# EAGLE design v1 (EAGLE 7.3.0)
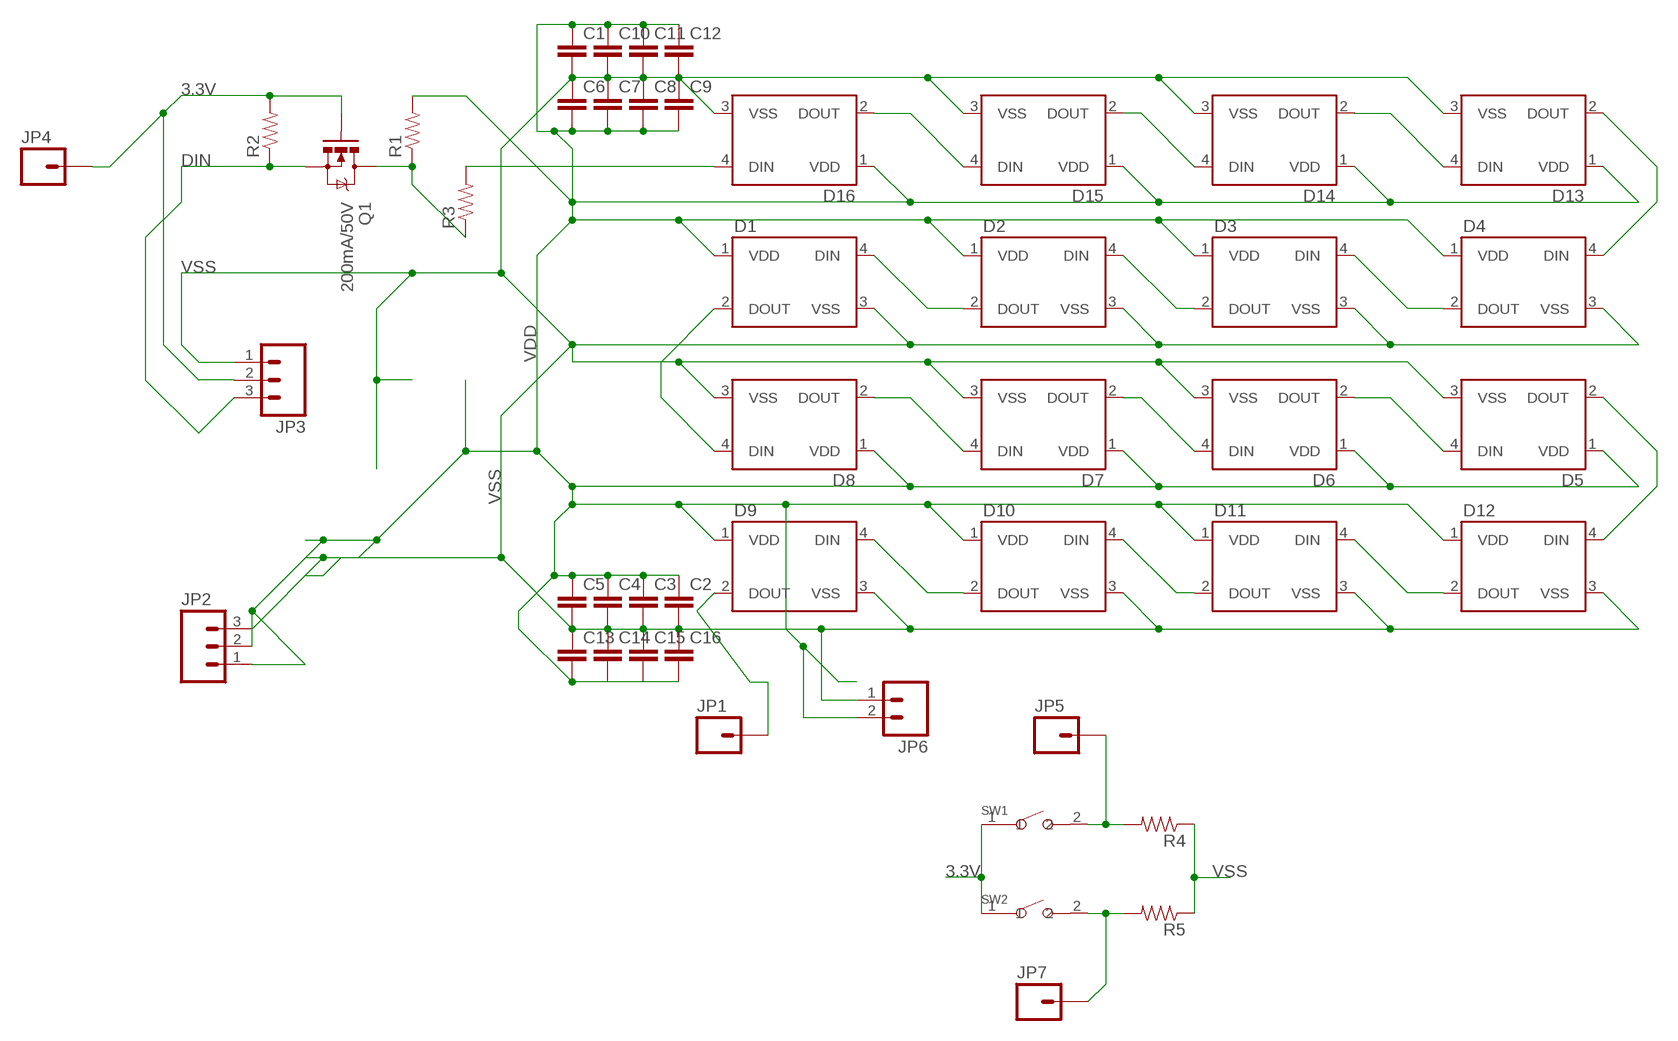
[diagram p0: schematic, sheet 1]

## Parts
C1  CAP0805  [0805]
C2  CAP0805  [0805]
C3  CAP0805  [0805]
C4  CAP0805  [0805]
C5  CAP0805  [0805]
C6  CAP0805  [0805]
C7  CAP0805  [0805]
C8  CAP0805  [0805]
C9  CAP0805  [0805]
C10  CAP0805  [0805]
C11  CAP0805  [0805]
C12  CAP0805  [0805]
C13  CAP0805  [0805]
C14  CAP0805  [0805]
C15  CAP0805  [0805]
C16  CAP0805  [0805]
D1  WS2812B  [WS2812B]
D2  WS2812B  [WS2812B]
D3  WS2812B  [WS2812B]
D4  WS2812B  [WS2812B]
D5  WS2812B  [WS2812B]
D6  WS2812B  [WS2812B]
D7  WS2812B  [WS2812B]
D8  WS2812B  [WS2812B]
D9  WS2812B  [WS2812B]
D10  WS2812B  [WS2812B]
D11  WS2812B  [WS2812B]
D12  WS2812B  [WS2812B]
D13  WS2812B  [WS2812B]
D14  WS2812B  [WS2812B]
D15  WS2812B  [WS2812B]
D16  WS2812B  [WS2812B]
JP1  M01PTH  [1X01]
JP2  M03PTH  [1X03]
JP3  M03PTH  [1X03]
JP4  M01PTH  [1X01]
JP5  M01PTH  [1X01]
JP6  M02PTH  [1X02]
JP7  M01PTH  [1X01]
Q1  200mA/50V  MOSFET-NCHANNELBSS138  [SOT23-3]
R1  RESISTOR0805-RES  [0805]
R2  RESISTOR0805-RES  [0805]
R3  RESISTOR0805-RES  [0805]
R4  RESISTOR0805-RES  [0805]
R5  RESISTOR0805-RES  [0805]
SW1  SMD-BUTTON(2P-6.0X3.0X2.5MM)-DHT-1163S  [SW2-4.0-6.0X3.0X2.5MM]
SW2  SMD-BUTTON(2P-6.0X3.0X2.5MM)-DHT-1163S  [SW2-4.0-6.0X3.0X2.5MM]

## Nets
3.3V: JP3.2 JP4.1 Q1.1(G) R2.2 SW1.1 SW2.1
DIN: JP3.3 Q1.2(S) R2.1
N$1: D3.4(DIN) D4.2(DOUT)
N$2: D2.4(DIN) D3.2(DOUT)
N$3: D1.4(DIN) D2.2(DOUT)
N$4: D11.4(DIN) D12.2(DOUT)
N$5: D10.4(DIN) D11.2(DOUT)
N$6: D9.4(DIN) D10.2(DOUT)
N$7: D4.4(DIN) D13.2(DOUT)
N$8: D5.2(DOUT) D12.4(DIN)
N$9: D1.2(DOUT) D8.4(DIN)
N$10: D7.4(DIN) D8.2(DOUT)
N$11: D6.4(DIN) D7.2(DOUT)
N$12: D5.4(DIN) D6.2(DOUT)
N$13: D15.4(DIN) D16.2(DOUT)
N$14: D14.4(DIN) D15.2(DOUT)
N$15: D13.4(DIN) D14.2(DOUT)
N$16: D9.2(DOUT) JP1.1
N$17: D16.4(DIN) R3.2
N$18: Q1.3(D) R1.1 R3.1
N$20: JP5.1 R4.2 SW1.2
N$21: JP7.1 R5.2 SW2.2
VDD: C1.1 C2.1 C3.1 C4.1 C5.1 C6.2 C7.2 C8.2 C9.2 C10.1 C11.1 C12.1 C13.2 C16.2 D1.1(VDD) D2.1(VDD) D3.1(VDD) D4.1(VDD) D5.1(VDD) D6.1(VDD) D7.1(VDD) D8.1(VDD) D9.1(VDD) D10.1(VDD) D11.1(VDD) D12.1(VDD) D13.1(VDD) D14.1(VDD) D15.1(VDD) D16.1(VDD) JP2.1 JP2.3 JP6.2 R1.2
VSS: C1.2 C2.2 C3.2 C4.2 C5.2 C6.1 C7.1 C8.1 C9.1 C10.2 C11.2 C12.2 C13.1 C14.1 C15.1 C16.1 D1.3(VSS) D2.3(VSS) D3.3(VSS) D4.3(VSS) D5.3(VSS) D6.3(VSS) D7.3(VSS) D8.3(VSS) D9.3(VSS) D10.3(VSS) D11.3(VSS) D12.3(VSS) D13.3(VSS) D14.3(VSS) D15.3(VSS) D16.3(VSS) JP2.2 JP3.1 JP6.1 R4.1 R5.1
Unconnected: C14.2 C15.2

## Library data of the parts
C1-C16 = SparkFun-Capacitors:CAP: Capacitor Standard 0603 ceramic capacitor, and 0.1" leaded capacitor.
D1-D16 = SparkFun-LED:WS2812B: WS2812B - Intelligent control LED integrated light source Technical Specifications: Power Supply Voltage (VDD): 3.5 to 5.3 V Input Voltage (VI): -0.5 to VDD+0.5 V Operating Junction Temperature (Topt): -25°C to +80°C Storage Temperature Range (Tstg): -55°C to +150°C; PROD_ID: DIO-12503
JP1 JP4 JP5 JP7 = SparkFun-Connectors:M01: Header 1 Standard 1-pin 0.1" header. Use with straight break away headers (SKU : PRT-00116), right angle break away headers (PRT-00553), swiss pins (PRT-00743), machine pins (PRT-00117), and female headers (PRT-00115).
JP2 JP3 = SparkFun-Connectors:M03: Header 3 Standard 3-pin 0.1" header. Use with straight break away headers (SKU : PRT-00116), right angle break away headers (PRT-00553), swiss pins (PRT-00743), machine pins (PRT-00117), and female headers (PRT-00115). Molex polarized connector foot print use with SKU : PRT-08232 with associated crimp pins and housings.
JP6 = SparkFun-Connectors:M02: Standard 2-pin 0.1" header. Use with - straight break away headers ( PRT-00116) - right angle break away headers (PRT-00553) - swiss pins (PRT-00743) - machine pins (PRT-00117) - female headers (PRT-00115) Molex polarized connector foot print use with: PRT-08233 with associated crimp pins and housings. 2.54_SCREWTERM for use with PRT-10571. 3.5mm Screw Terminal footprints for PRT-08084 5mm Screw Terminal footprints for use with PRT-08432
Q1 = SparkFun-DiscreteSemi:MOSFET-NCHANNEL: Common NMOSFET Parts MFG P/N Store ID Prod ID FDD8780 TRANS-09984 SI7820DN TRANS-11055 FDS6630A IC-08089 2N7002PW TRANS-11151 FQP30N06L COM-10213 TRANS-10060 BSS123LT1G TRANS-08345 BSS138 TRANS-00830 BS170 2N7000; PROD_ID: TRANS-00830
R1-R5 = SparkFun-Passives:RESISTOR: Resistor Basic schematic elements and footprints for 0603, 1206, and PTH resistors.
SW1 SW2 = Seeed-OPL-Switch:SMD-BUTTON(2P-6.0X3.0X2.5MM): 311020029

## Board
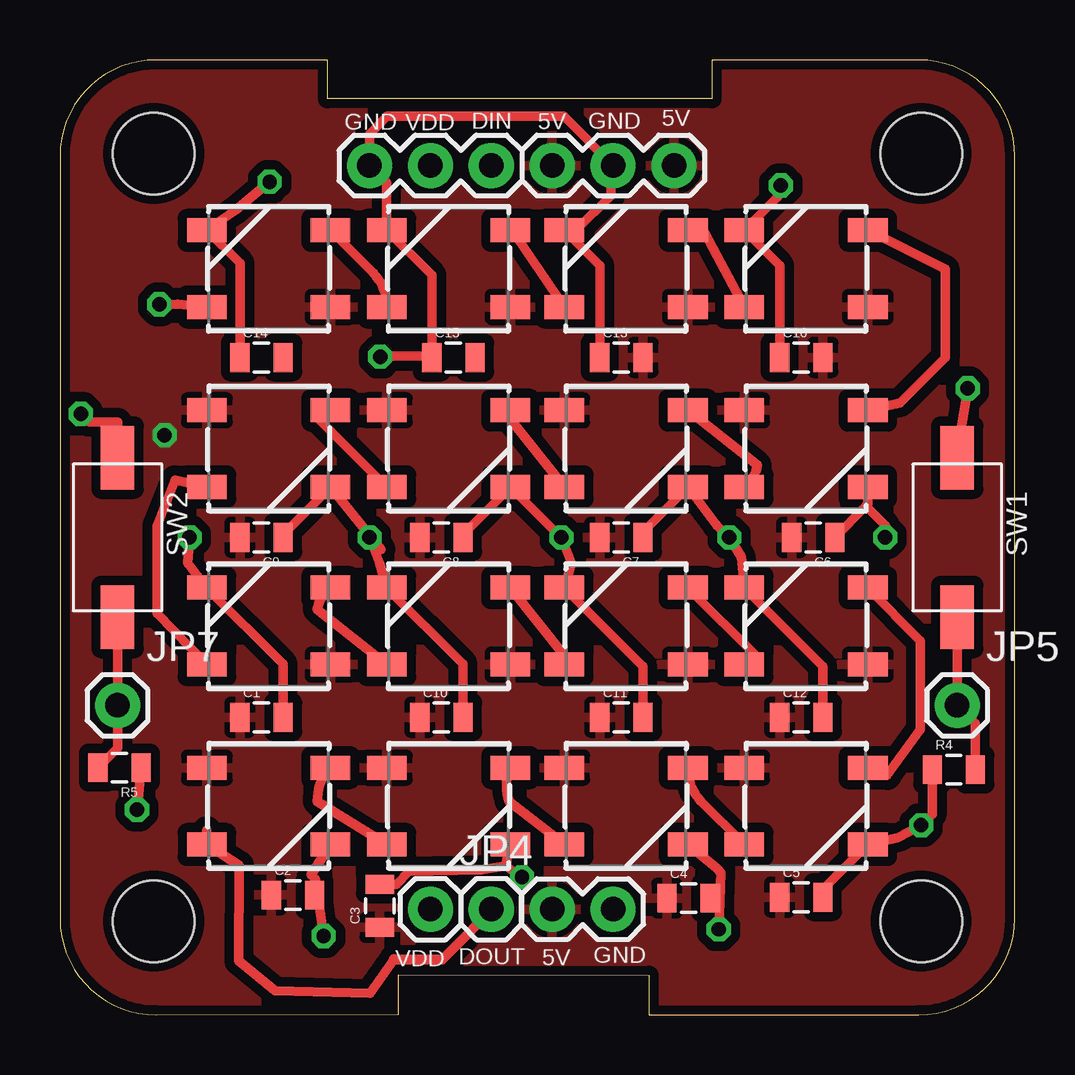
[diagram p1: board, top side]
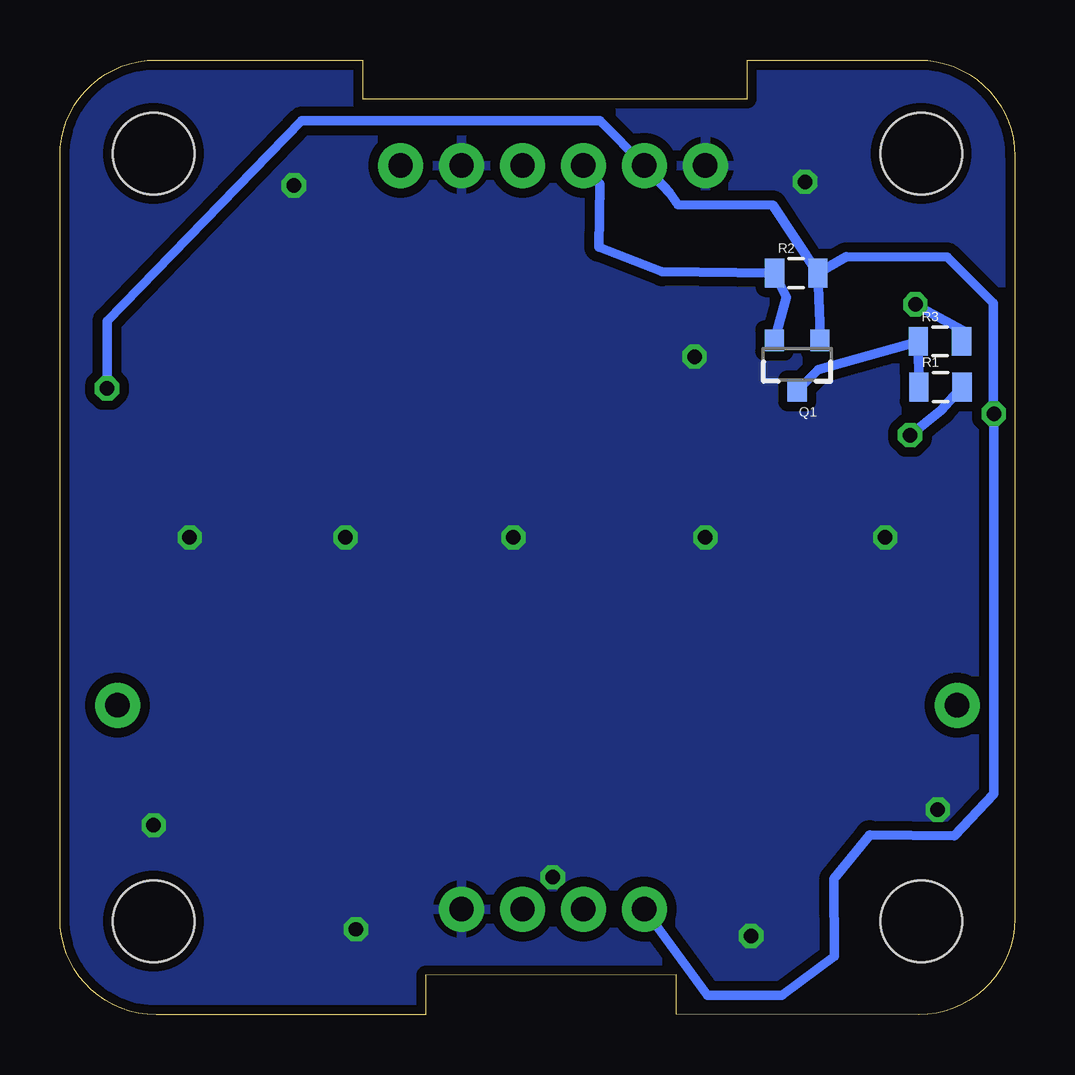
[diagram p2: board, bottom side, seen from below]

Size 39.8 x 39.8 mm. Coordinates in mm from the lower left corner, seen from the top.
Outline: 0,35.8 0,4 arc90 4,0 14.11,0.01 14.11,1.66 24.56,1.65 24.56,0 35.8,0 arc90 39.8,4 39.8,35.8 arc90 35.8,39.8 27.18,39.8 27.18,38.18 11.15,38.18 11.15,39.8 4,39.8 arc90 0,35.8
Copper layers (1*16): Top 0.035mm / dielectric 1.5mm / Bottom 0.035mm
Design rules "DFRobot_Eagle_Rule_v0.4": minimum track width 6mil, minimum drill 12mil, track to track 6mil, track to pad 6mil, pad to pad 6mil, via to via 6mil, smd to smd 0mil, copper to edge 10mil, drill to drill 10mil, minimum pad ring 12mil, minimum via ring 8mil, stop-mask expansion 2mil, vias tented up to drill 25mil, thermal gap 10mil
Holes 3.4 mm at 3.9,3.9 3.9,35.9 35.9,35.9 35.9,3.9

### Footprints (pad centres in the part's own frame; a part is rotated, then mirrored left to right if it is on the bottom)
0805 = smd 0.8 x 1.2: 1 -0.9,0; 2 0.9,0
WS2812B = smd 1.651 x 1: 1 -2.577,1.6; 2 -2.577,-1.6; 3 2.577,-1.6; 4 2.577,1.6
1X01 = drill 1.016 pad 1.88: 1 0,0
1X03 = drill 1.016 pad 1.88: 1 0,0; 2 2.54,0; 3 5.08,0
1X02 = drill 1.016 pad 1.88: 1 0,0; 2 2.54,0
SOT23-3 = smd 0.8 x 0.9: 1 -0.95,-1; 2 0.95,-1; 3 0,1.1
SW2-4.0-6.0X3.0X2.5MM = smd 2.65 x 1.4: 1 -3.325,0; 2 3.325,0

### Placement (x,y rotation side)
C1  8.4,12.4 0 top
C2  9.71,4.99 0 top
C3  13.33,4.54 90 top
C4  26.2,4.86 0 top
C5  30.9,4.9 0 top
C6  31.4,19.9 180 top
C7  23.4,19.9 180 top
C8  15.9,19.9 180 top
C9  8.4,19.9 180 top
C10  15.9,12.4 0 top
C11  23.4,12.4 0 top
C12  30.9,12.4 0 top
C13  23.4,27.4 0 top
C14  8.4,27.4 0 top
C15  16.4,27.4 0 top
C16  30.9,27.4 0 top
D1  8.7,23.6 0 top
D2  16.2,23.6 0 top
D3  23.6,23.6 0 top
D4  31.1,23.6 0 top
D5  31.1,16.2 180 top
D6  23.6,16.2 180 top
D7  16.2,16.2 180 top
D8  8.7,16.2 180 top
D9  8.7,8.7 0 top
D10  16.2,8.7 0 top
D11  23.6,8.7 0 top
D12  31.1,8.7 0 top
D13  31.1,31.1 180 top
D14  23.6,31.1 180 top
D15  16.2,31.1 180 top
D16  8.7,31.1 180 top
JP1  17.98,4.4 0 top
JP2  20.52,35.4 0 top
JP3  12.9,35.4 0 top
JP4  15.44,4.4 0 top
JP5  37.4,12.9 0 top
JP6  23.06,4.4 180 top
JP7  2.4,12.9 0 top
Q1  9.07,27.11 180 bottom
R1  3.1,26.17 0 bottom
R2  9.11,30.92 0 bottom
R3  3.12,28.07 0 bottom
R4  37.26,10.22 0 top
R5  2.48,10.3 180 top
SW1  37.4,19.9 270 top
SW2  2.4,19.9 270 top

### Tracks (layer width: path | path; a pad name or v marks a point on that pad's centre or on a via)
3.3V  (via drill 0.6)
  Top 0.4: SW1.1 37.6,24.58 v37.84,26.11 | SW2.1 2.4,24.7 1.22,24.7 v0.87,25.05
  Bottom 0.4: R2.2 8.12,28.83 Q1.1 | R2.2 10.09,33.75 14.04,33.77 14.39,34.26 JP3.2 17.3,37.26 29.72,37.26 37.84,28.92 v37.84,26.11 | R2.2 7.02,31.6 2.82,31.59 0.89,29.66 0.89,25.07 v0.87,25.05 0.87,9.2 2.51,7.46 6.05,7.5 7.55,5.66 7.51,2.44 9.71,0.82 12.81,0.82 JP4.1
DIN
  Bottom 0.4: Q1.2 9.52,29.91 R2.1 14.7,30.97 17.34,31.99 17.28,34.62 JP3.3
N$1
  Top 0.4: D4.2 arc45 29.07,22.9 D3.4
N$2
  Top 0.4: D2.4 arc45 18.73,24.9 D3.2
N$3
  Top 0.4: D1.4 arc45 10.73,24.9 D2.2
N$4
  Top 0.4: D11.4 arc45 26.73,8.9 D12.2
N$5
  Top 0.4: D10.4 arc45 18.73,8.9 D11.2
N$6
  Top 0.4: D9.4 arc45 10.73,8.9 D10.2
N$7
  Top 0.4: D13.2 36.9,31.08 36.9,27.4 35,25.5 D4.4
N$8
  Top 0.4: D5.2 35.87,15.58 35.87,11.9 34.48,9.98 D12.4
N$9
  Top 0.4: D8.4 4.05,16.72 4.05,20.4 4.8,22.3 D1.2
N$10
  Top 0.4: D8.2 arc45 10.73,16.9 D7.4
N$11
  Top 0.4: D6.4 arc45 21.07,14.9 D7.2
N$12
  Top 0.4: D5.4 arc45 29.07,14.9 D6.2
N$13
  Top 0.4: D15.4 arc45 13.07,30.9 D16.2
N$14
  Top 0.4: D15.2 arc45 18.73,32.9 D14.4
N$15
  Top 0.4: D14.2 arc45 26.73,32.9 D13.4
N$16
  Top 0.4: 6.12,7.68 D9.2 7.47,6.23 7.45,2.24 8.97,1 12.92,0.89 13.92,2.32
  Top 0.406: 13.92,2.32 15.94,2.31 16.94,3.31 JP1.1
N$17  (via drill 0.6)
  Top 0.4: D16.4 4.9,29.62 v4.14,29.61
  Bottom 0.4: R3.2 2.18,28.53 v4.14,29.61
N$18
  Bottom 0.4: R1.1 4,26.2 R3.1 8.18,26.9 Q1.3
N$20
  Top 0.4: R4.2 38.16,12.14 JP5.1 SW1.2 | SW1.2 37.4,17.09 37.32,17.17 37.32,16.65 SW1.2
N$21
  Top 0.4: SW2.2 JP7.1 2.4,11.12 R5.2
VDD  (via drill 0.6)
  Bottom 0.4: v4.36,24.16 3.06,25.2 R1.2
  pour Top (isolate 0.4): 0.4,39.4 0.4,0.4 39.4,0.4 39.4,39.4 17.9,39.4
VSS  (via drill 0.6)
  Top 0.4: v10.99,3.28 10.65,5.65 | 10.65,5.65 10.48,5.82 D9.3 | v19.26,5.73 18.57,6.2 | 18.57,6.2 D10.3 | v27.46,3.56 27.55,5.92 | 27.55,5.92 27.38,6.09 D11.3 | v8.74,34.72 7.32,33.54 D16.3 7.5,31.32 C14.1 | v30.05,34.57 29.9,34.08 D13.3 30,31.22 C16.1 | v5.4,19.9 5.32,18.82 D8.3 9.3,14.62 C1.2 | C2.2 10.68,5.31 10.65,5.65 | 18.57,6.2 17.56,6.03 14.56,5.97 14.03,5.44 C3.2 | C4.2 27.5,5.08 27.55,5.92 | C5.2 31.8,5.22 D12.3 34.9,7.38 v35.9,7.9 36.36,8.36 R4.1 | C12.2 31.8,14.52 D5.3 28.4,19.08 v27.9,19.9 27.38,20.4 D3.3 24.3,20.12 C7.1 | C11.2 24.3,14.52 D6.3 21.32,18.82 v20.9,19.9 20.88,19.9 D2.3 16.8,20.02 C8.1 | C10.2 16.8,14.62 D7.3 13.32,18.82 v12.9,19.9 13.38,19.4 D1.3 9.3,20.02 C9.1 | D4.3 33.68,21.28 33.6,21.2 | 33.6,21.2 C6.1 | v34.4,19.9 34.4,20.4 33.6,21.2 | C15.1 15.5,30.82 D15.3 13.62,34.68 JP3.1 12.9,36.71 13.64,37.45 21.01,37.45 JP2.2 22.96,35.3 22.96,34.15 21.51,32.7 D14.3 22.5,31.22 C13.1 | R5.1 v3.21,8.55 | 15.42,27.46 13.38,27.46 v13.35,27.43
  pour Bottom (isolate 0.4): 0.4,39.4 0.4,0.4 39.4,0.4 39.4,39.4 15.9,39.4

### Text on the board
tNames: GND | VDD | DIN | 5V | GND | 5V | VDD | DOUT | 5V | GND